# Altium schematic sheet Speaker.SchDoc
size A4; DocumentNumber: 7; SheetNumber: 7; SheetTotal: 8
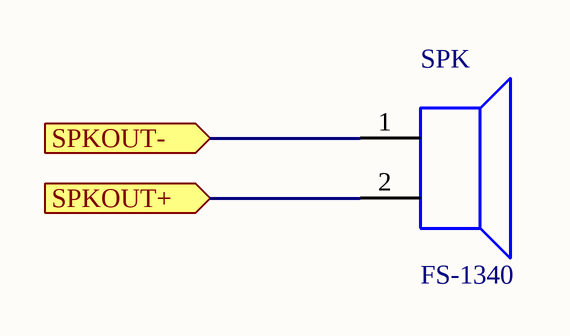
[diagram p0: Speaker.SchDoc]

## Parts
SPK  FS-1340  [SPKR_SMS-1508MS-HT-R]

## Ports
SPKOUT+ (in), SPKOUT- (in)

## Nets
SPKOUT+: SPK.2(-) ; port SPKOUT+
SPKOUT-: SPK.1(+) ; port SPKOUT-

## Notes on the sheet
- Size:
- Date:
- Sheet Name:
- A4
- Sheet
- Time:
- of
- Author :
- Hatim Saad
- Project:
- File:

## Library data of the parts
SPK = FS-1340: Speakers ROHS; ComponentLink1Description: LCSC; ComponentLink1URL: https://www.lcsc.com/product-detail/Speakers_FUET-FS-1340_C482342.html